# Altium schematic sheet 涂鸦拓展板_SCH_2021-06-02.schdoc
size 305 x 214 mm
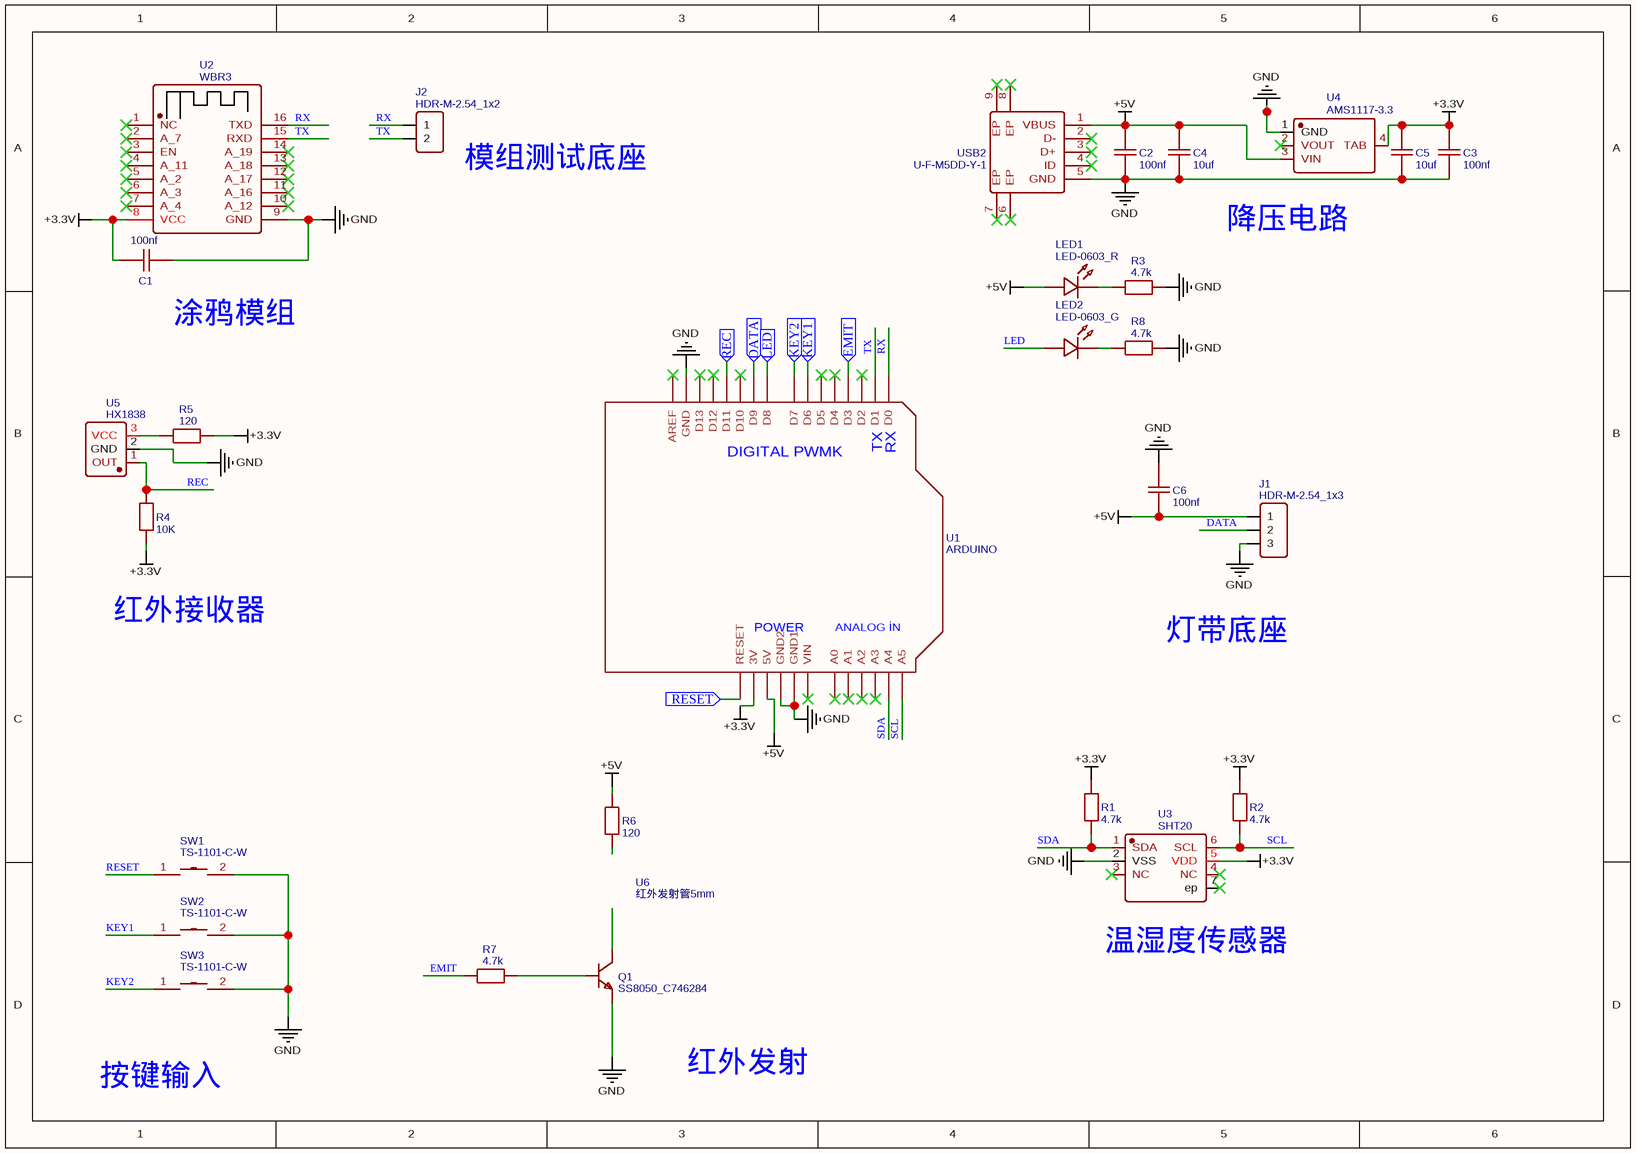
[diagram p0: 涂鸦拓展板_SCH_2021-06-02.schdoc]

## Parts
C1  100nf  [C0603]
C2  100nf  [C0603]
C3  100nf  [C0603]
C4  10uf  [C0603]
C5  10uf  [C0603]
C6  100nf  [C0603]
J1  HDR-M-2.54_1x3  [HDR-M-2.54_1X3]
J2  HDR-M-2.54_1x2  [HDR-M-2.54_1X2]
LED1  LED-0603_R  [LED0603_RED]
LED2  LED-0603_G  [LED0603_GREEN]
Q1  SS8050_C746284  [SOT-23-3_L2.9-W1.3-P1.90-LS2.4-BR]
R1  4.7k  [R0603]
R2  4.7k  [R0603]
R3  4.7k  [R0603]
R4  10K  [R0805]
R5  120  [R0805]
R6  120  [R0805]
R7  4.7k  [R0805]
R8  4.7k  [R0603]
SW1  TS-1101-C-W  [SW-SMD_L6.0-W3.3-LS8.0]
SW2  TS-1101-C-W  [SW-SMD_L6.0-W3.3-LS8.0]
SW3  TS-1101-C-W  [SW-SMD_L6.0-W3.3-LS8.0]
U1  ARDUINO  [ARDUINO]
U2  WBR3  [WBR3]
U3  SHT20  [DFN-6_L3.0-W3.0-P0.95-TR-EP]
U4  AMS1117-3.3  [SOT-223-3_L6.5-W3.4-P2.30-LS7.0-BR]
U5  HX1838  [HX1838]
U6  红外发射管5mm  [123]
USB2  U-F-M5DD-Y-1  [MICRO-USB-SMD_U-F-M5DD-Y-1]

## Ports
DATA (in), EMIT (in), KEY1 (in), KEY2 (in), LED (in), REC (in), RESET (in)

## Nets
+3.3V: C1.1 C3.2 C5.2 R1.2 R2.2 R4.1 R5.2 U1.3V U2.8(VCC) U3.5(VDD) U4.4(TAB)
+5V: C2.2 C4.2 C6.1 J1.1 LED1.1 R6.2 U1.5V U4.3(VIN) USB2.1(VBUS)
GND: C1.2 C2.1 C3.1 C4.1 C5.1 C6.2 J1.3 Q1.2(E) R3.2 R8.2 SW1.2 SW2.2 SW3.2 U1.GND U1.GND1 U1.GND2 U2.9(GND) U3.2(VSS) U4.1(GND) U5.2(GND) USB2.5(GND)
DATA: U1.D9 ; port DATA
DATA: J1.2  [a separate net that carries the same name]
EMIT: U1.D3 ; port EMIT
EMIT: R7.1  [a separate net that carries the same name]
KEY1: U1.D6 ; port KEY1
KEY1: SW2.1  [a separate net that carries the same name]
KEY2: U1.D7 ; port KEY2
KEY2: SW3.1  [a separate net that carries the same name]
LED: U1.D8 ; port LED
LED: LED2.1  [a separate net that carries the same name]
REC: U1.D11 ; port REC
REC: R4.2 U5.1(OUT)  [a separate net that carries the same name]
RESET: U1.RESET ; port RESET
RESET: SW1.1  [a separate net that carries the same name]
RX: J2.1 U1.D0 U2.16(TXD)
SCL: R2.1 U1.A5 U3.6(SCL)
SDA: R1.1 U1.A4 U3.1(SDA)
TX: J2.2 U1.D1 U2.15(RXD)
NetLED1_2: LED1.2 R3.1
NetLED2_2: LED2.2 R8.1
NetQ1_1: Q1.1(B) R7.2
NetR5_1: R5.1 U5.3(VCC)

Not connected (* = marked no-connect by the designer): Q1 3(C); R6 1; U1 A0* A1* A2* A3* AREF* D2* D4* D5* D10* D12* D13* VIN*; U2 1(NC)* 2(A_7)* 3(EN)* 4(A_11)* 5(A_2)* 6(A_3)* 7(A_4)* 10(A_12)* 11(A_16)* 12(A_17)* 13(A_18)* 14(A_19)*; U3 3(NC)* 4(NC)* 7(ep)*; U4 2(VOUT)*; USB2 2(D-)* 3(D+)* 4(ID)* 6(EP)* 7(EP)* 8(EP)* 9(EP)*

## Notes on the sheet
- (near J2) 模组测试底座
- 降压电路
- (near C1) 涂鸦模组
- 红外接收器
- 灯带底座
- (near U3) 温湿度传感器
- 按键输入
- 红外发射
- (in symbol ARDUINO) TX; RX; DIGITAL PWMK; POWER; ANALOG İN

## Library data of the parts
C1-C3 C6 = 100nf: nameAlias: Value(F); Contributor: LCEDA_Lib; spicePre: C; spiceSymbolName: C_0603_US
C4 C5 = 10uf: nameAlias: Value(F); Contributor: LCEDA_Lib; spicePre: C; spiceSymbolName: C_0603_US
J1 = HDR-M-2.54_1x3: Contributor: LCEDA_Lib; BOM_Supplier Part: C180248; BOM_Supplier: LCSC; spicePre: J; spiceSymbolName: HDR-M-2.54_1x3
J2 = HDR-M-2.54_1x2: Contributor: LCEDA_Lib; BOM_Supplier Part: C124375; BOM_Supplier: LCSC; spicePre: J; spiceSymbolName: HDR-M-2.54_1x2
LED1 = LED-0603_R: BOM_Manufacturer: EVERLIGHT(台湾亿光); BOM_Manufacturer Part: 19-217/R6C-AL1M2VY/3T; Contributor: LCEDA_01; BOM_Supplier Part: C72044; BOM_Supplier: LCSC; spicePre: L; spiceSymbolName: LED-0603_R
LED2 = LED-0603_G: BOM_Manufacturer: EVERLIGHT(台湾亿光); BOM_Manufacturer Part: 19-217/GHC-YR1S2/3T; Contributor: LCEDA_Lib; BOM_Supplier Part: C72043; BOM_Supplier: LCSC; spicePre: L; spiceSymbolName: LED-0603_G
Q1 = SS8050_C746284: BOM_Manufacturer: HT(Shenzhen Jinyu Semicon); BOM_Manufacturer Part: SS8050; Contributor: LCSC; BOM_Supplier: LCSC; BOM_Supplier Part: C746284; spicePre: Q; spiceSymbolName: SS8050_C746284
R1-R3 R7 R8 = 4.7k: nameAlias: Value(Ω); Contributor: LCEDA_Lib; spicePre: R
  R1-R3 R8: spiceSymbolName: R_0603_EU
  R7: spiceSymbolName: R_0805_EU
R4 = 10K: nameAlias: Value(Ω); Contributor: LCEDA_Lib; spicePre: R; spiceSymbolName: R_0805_EU
R5 R6 = 120: nameAlias: Value(Ω); Contributor: LCEDA_Lib; spicePre: R; spiceSymbolName: R_0805_EU
SW1-SW3 = TS-1101-C-W: BOM_Manufacturer: XKB Connectivity(中国星坤); Contributor: LCSC; BOM_Supplier: LCSC; BOM_Supplier Part: C318938; BOM_Manufacturer Part: TS-1101-C-W; BOM_JLCPCB Part Class: Extended Part; spicePre: S; spiceSymbolName: TS-1101-C-W
U1 = ARDUINO: Contributor: Adafruit; sourceId: qM4YgyQKE; timeStamp: 1475313485; spicePre: U; spiceSymbolName: ARDUINO
U2 = WBR3: Contributor: 退役熬夜选手; spicePre: U; spiceSymbolName: WBR3
U3 = SHT20: BOM_Manufacturer: Sensirion; BOM_Supplier: LCSC; BOM_Manufacturer Part: SHT20; BOM_Supplier Part: C53865; BOM_JLCPCB Part Class: Extended Part; spicePre: U; spiceSymbolName: SHT20
U4 = AMS1117-3.3: BOM_Manufacturer: PUOLOP; Contributor: LCSC; BOM_Supplier: LCSC; BOM_Supplier Part: C351784; BOM_Manufacturer Part: AMS1117-3.3; BOM_JLCPCB Part Class: Extended Part; spicePre: U; spiceSymbolName: AMS1117-3.3_C351784
U5 = HX1838: BOM_Manufacturer Part: 0; Contributor: EDAUSER001; link: https://item.taobao.com/item.htm?spm=a1z09.2.0.0.1ea22e8d48OTx3&id=522552967131&_u=1esjrio323d; spicePre: U; spiceSymbolName: HX1838
U6 = 红外发射管5mm: Contributor: yidiandian; spicePre: U; spiceSymbolName: 红外发射管5mm
USB2 = U-F-M5DD-Y-1: BOM_Manufacturer: HRO; BOM_Supplier: LCSC; BOM_Manufacturer Part: U-F-M5DD-Y-1; BOM_Supplier Part: C91467; BOM_JLCPCB Part Class: Extended Part; spicePre: U; spiceSymbolName: U-F-M5DD-Y-1